# Altium schematic sheet MainSwitch.SchDoc
size A4; DocumentNumber: 7; SheetNumber: 7; SheetTotal: 11
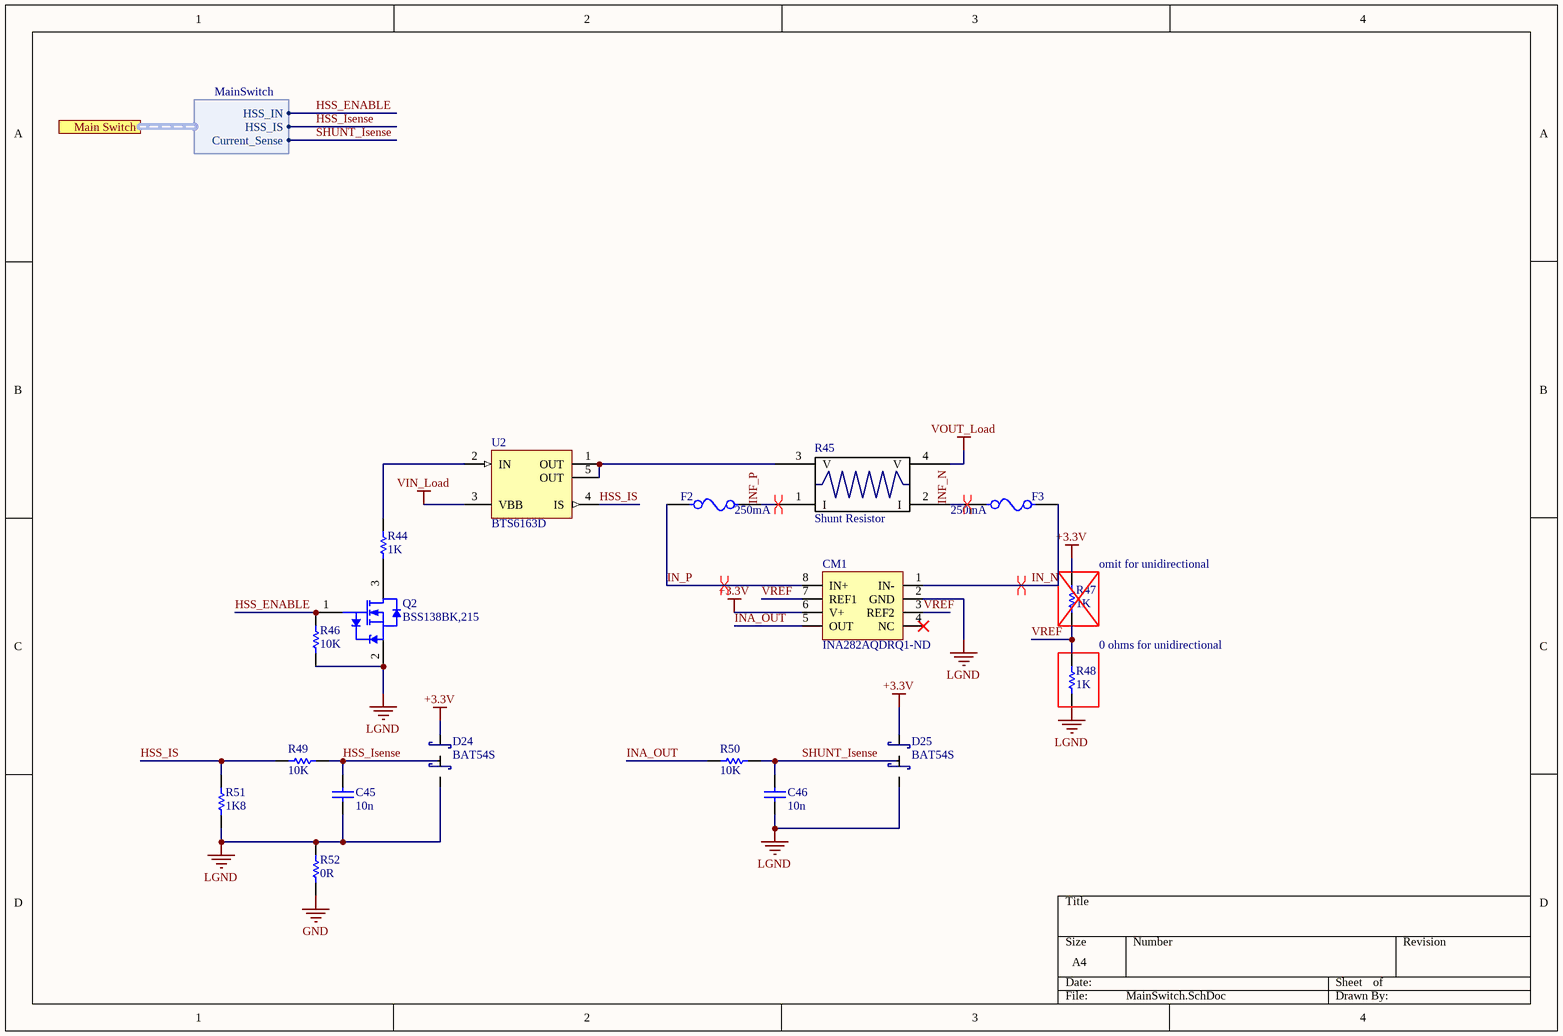
[diagram p0: MainSwitch.SchDoc]

## Parts
C45  10n  [CAPC0603(1608)55_N]
C46  10n  [CAPC0603(1608)55_N]
CM1  Supplier Part Number 1: INA282AQDRQ1-ND  [SO8_N]  (hidden comment: INA282AQDRQ1)
D24  BAT54S  [_SOT23-3N]
D25  BAT54S  [_SOT23-3N]
F2  250mA  [RESC0603(1608)_N]
F3  250mA  [RESC0603(1608)_N]
Q2  BSS138BK,215  [NXP-SOT23_L]
R44  1K  [RESC0603(1608)_N]
R45  Shunt Resistor  [SHUNT FC4L110]
R46  10K  [RESC0603(1608)_N]
R47  1K  [RESC0603(1608)_N]
R48  1K  [RESC0603(1608)_N]
R49  10K  [RESC0603(1608)_N]
R50  10K  [RESC0603(1608)_N]
R51  1K8  [RESC0603(1608)_N]
R52  0R  [RESC0603(1608)_N]
U2  BTS6163D  [INF-PG-TO252-5-11_L]

## Ports
Main Switch (harness MainSwitch)

## Harnesses
MainSwitch: HSS_IN, HSS_IS, Current_Sense

## Nets
+3.3V: CM1.6(V+) D24.2 D25.2 R47.2
GND: R52.1
LGND: C45.1 C46.1 CM1.2(GND) D24.1 D25.1 Q2.2(S) R46.1 R48.1 R51.1 R52.2
VIN_Load: U2.3(VBB)
VOUT_Load: R45.4(V)
HSS_ENABLE: Q2.1(G) R46.2 ; port Main Switch.HSS_IN
HSS_IS: R49.1 R51.2 U2.4(IS)
HSS_Isense: C45.2 D24.3 R49.2 ; port Main Switch.HSS_IS
IN_N: CM1.1(IN-) F3.1
IN_P: CM1.8(IN+) F2.2
INA_OUT: CM1.5(OUT) R50.1
INF_N: F3.2 R45.2(I)
INF_P: F2.1 R45.1(I)
SHUNT_Isense: C46.2 D25.3 R50.2 ; port Main Switch.Current_Sense
VREF: CM1.3(REF2) CM1.7(REF1) R47.1 R48.2
NetQ2_3: Q2.3(D) R44.1
NetR44_2: R44.2 U2.2(IN)
NetR45_3: R45.3(V) U2.1(OUT) U2.5(OUT)

Not connected (* = marked no-connect by the designer): CM1 4(NC)*

## Layout directives
differential pair: IN_N, IN_P, INF_N, INF_P

## Notes on the sheet
- (near R47) omit for unidirectional
- 0 ohms for unidirectional

## Library data of the parts
C45 C46 = Cap 10n: Keramikvielschichtkondensator, SMD, Baureihe MC, ± 10%; Manufacturer: TDK; Voltage Rating: 50V; OC_MOUSER: CGA3E2X7R1H103K080AA; Value: 10n; PackageReference: 0603; Tolerance: ± 10%
CM1 = INA282AQDRQ1: SP Amp Current Shunt Monitor Single 18V Automotive 8-Pin SOIC T/R; Manufacturer: Texas Instruments; Common Mode Rejection Ratio: 120dB; Min Supply Voltage: 2.7V; Input Offset Voltage (Vos): 70uV; Nominal Supply Current: 900uA; Number of Channels: 1; Gain Bandwidth Product: 10kHz; Accuracy: 0.4%; Voltage Gain: 33.98dB; Power Supply Rejection Ratio (PSRR): 110.46dB; Input Resistance: 6kR; Supplier 1: Digi-Key; Manufacturer Part Number: INA282AQDRQ1; Stock 1: 0; Mount: Surface Mount; Case/Package: SOIC; Number of Pins: 8; Min Operating Temperature: -40°C; Max Operating Temperature: 125°C; Max Supply Voltage: 18V; Packaging: Tape and Reel; Package Quantity: 2500; Number of Elements: 1; Lead Free: Lead Free; ComponentLink1URL: http://www.ti.com/lit/gpn/ina282-q1; ComponentLink1Description: http://www.ti.com/lit/gpn/ina282-q1; ComponentLink2URL: http://www.ti.com/general/docs/lit/getliterature.tsp?genericPartNumber=INA284-Q1&&fileType=pdf; ComponentLink2Description: http://www.ti.com/general/docs/lit/getliterature.tsp?genericPartNumber=INA284-Q1&&fileType=pdf; ComponentLink3URL: http://www.ti.com/lit/ds/symlink/ina282-q1.pdf; ComponentLink3Description: http://www.ti.com/lit/ds/symlink/ina282-q1.pdf
F2 F3 = Bel Fuse C2Q250: Fuse, Fast Blow 250mA, 63VDC; Voltage Rating AC: 32V; Voltage Rating DC: 63; OC_Mouser: 530-C2Q250; Value: 250mA; PackageReference: 0603; Manufacturer: Bel Fuse; Characteristic: Fast Blow
Q2 = CMP-1259-00087-1: N-Channel Trench MOSFET, 60 V, 0.36 A, -55 to 150 degC, 3-Pin SOT23, Tape and Reel; Manufacturer: NXP Semiconductors; Channel Type: N; IDM [max] (A): 1.2; VDS [max] (V): 60; Packing: Tape & Reel; ID [max] (A): 0.36; Automotive Qualified: Y; VGSth [typ] (V): 1.1; PackageReference: SOT23; Code_JEDEC: TO-236AB; PackageDescription: 3-Pin Small Outline Transistor Package, Body 2.9 x 1.3 mm, Pitch 0.95 mm; ComponentLink2URL: http://www.nxp.com/documents/data_sheet/BSS138BK.pdf; PartNumber: BSS138BK,215; DatasheetVersion: Rev. 1; ComponentLink3Description: Package Specification; ComponentLink3URL: http://www.nxp.com/documents/outline_drawing/sot023_po.pdf; Mounting Technology: Surface Mount; ComponentLink1URL: http://www.nxp.com/; ComponentLink1Description: Manufacturer URL; ComponentLink2Description: Datasheet; PackageVersion: 06-03-16, 03/2006
R44 R47 R48 = Res 1K: Chipwiderstand, SMD, Baureihe MC, 1%; Manufacturer: Multicomp; Power: 100mW; PackageReference: 0603; Value: 1K; OC_FARNELL: 9330380
R45 = Shunt 0R003: pin to pad: 1>3 2>4 3>1 4>2; Manufacturer: OHMITE; Value: 0R003; LatestRevisionDate: 17-Jul-2002; LatestRevisionNote: Re-released for DXP Platform.; Publisher: Altium Limited; OC_Farnell: 2363982
R46 R49 R50 = Res 10K: Chipwiderstand, SMD, Baureihe MC, 1%; Manufacturer: Multicomp; Power: 100mW; PackageReference: 0603; Value: 10K; OC_FARNELL: 9330399
R51 = Res 1K8: Chipwiderstand, SMD, Baureihe MC, 1%; Manufacturer: Multicomp; Power: 100mW; PackageReference: 0603; Value: 1K8; OC_FARNELL: 9330712
R52 = Res 0R: Chipwiderstand, SMD, Baureihe MC, 1%; Manufacturer: Multicomp; Power: 100mW; PackageReference: 0603; Value: 0R; OC_FARNELL: 9331662
U2 = BTS6163D: PROFET Smart Highside Power Switch, 1 Channel, 6.5 A Load Current, -40 to 150 degC, PG-TO252-5-11, Reel, Green; Manufacturer: Infineon; Channels: 1; Green: TRUE; Group: Automotive Qualified; Load Current (typ): 6.5 A; Ptot (max): 59 W; Recommended Operating Voltage Max.: 62 V; Recommended Operating Voltage Min.: 5.5 V; RON @ 25degreesC: 20 mOhm; RON(max) @ 150degreesC: 40 mOhm; toff (max): 500 us; ton (max): 300 us; DatasheetVersion: Rev. 1.0; PackageVersion: Nov-10; PackageReference: PG-TO252-5-11; PackageDescription: 5-Pin Plastic (Green) Transistor Single Outline Package, 6.5 x 6.12 mm Body, 1.14 mm Pitch; Supplier 1: Digi-Key; Supplier Part Number 1: BTS6163DINTR-ND; Supplier 2: Digi-Key; Supplier Part Number 2: BTS6163DINCT-ND; Supplier 3: Digi-Key; Supplier Part Number 3: BTS6163DINDKR-ND; Supplier 4: Mouser; Supplier Part Number 4: 726-BTS6163D; Halogen-free: TRUE; Packing: Reel; Mounting Technology: Surface Mount; PartNumber: BTS6163D; ComponentLink1Description: Manufacturer URL; ComponentLink1URL: http://www.infineon.com/; ComponentLink2Description: Datasheet; ComponentLink2URL: http://www.infineon.com/dgdl/BTS6163D_DS_v10.pdf?folderId=db3a304314dca389011537739e37155f&fileId=db3a3043183a95550118606cdf2336a2&location=en.Products.Automotive_ICs.Smart_High-_and_Low-Side_Switches.PROFET__-_Smart_High_Side_Switches.DATASHEET.BTS6163D_DS_v10.pdf; ComponentLink3Description: Package Specification; ComponentLink3URL: http://www.infineon.com/dgdl/TLE7276-Data+Sheet-+v1_11.pdf?folderId=db3a304412b407950112b408e8c90004&fileId=db3a304412b407950112b436c53f66c8&sId=db3a30433db6f09f013dc0e43c0428c1
D24 D25 = BAT54S: Farnell: 1612328